# EAGLE design kline to db9 (EAGLE 4.13)
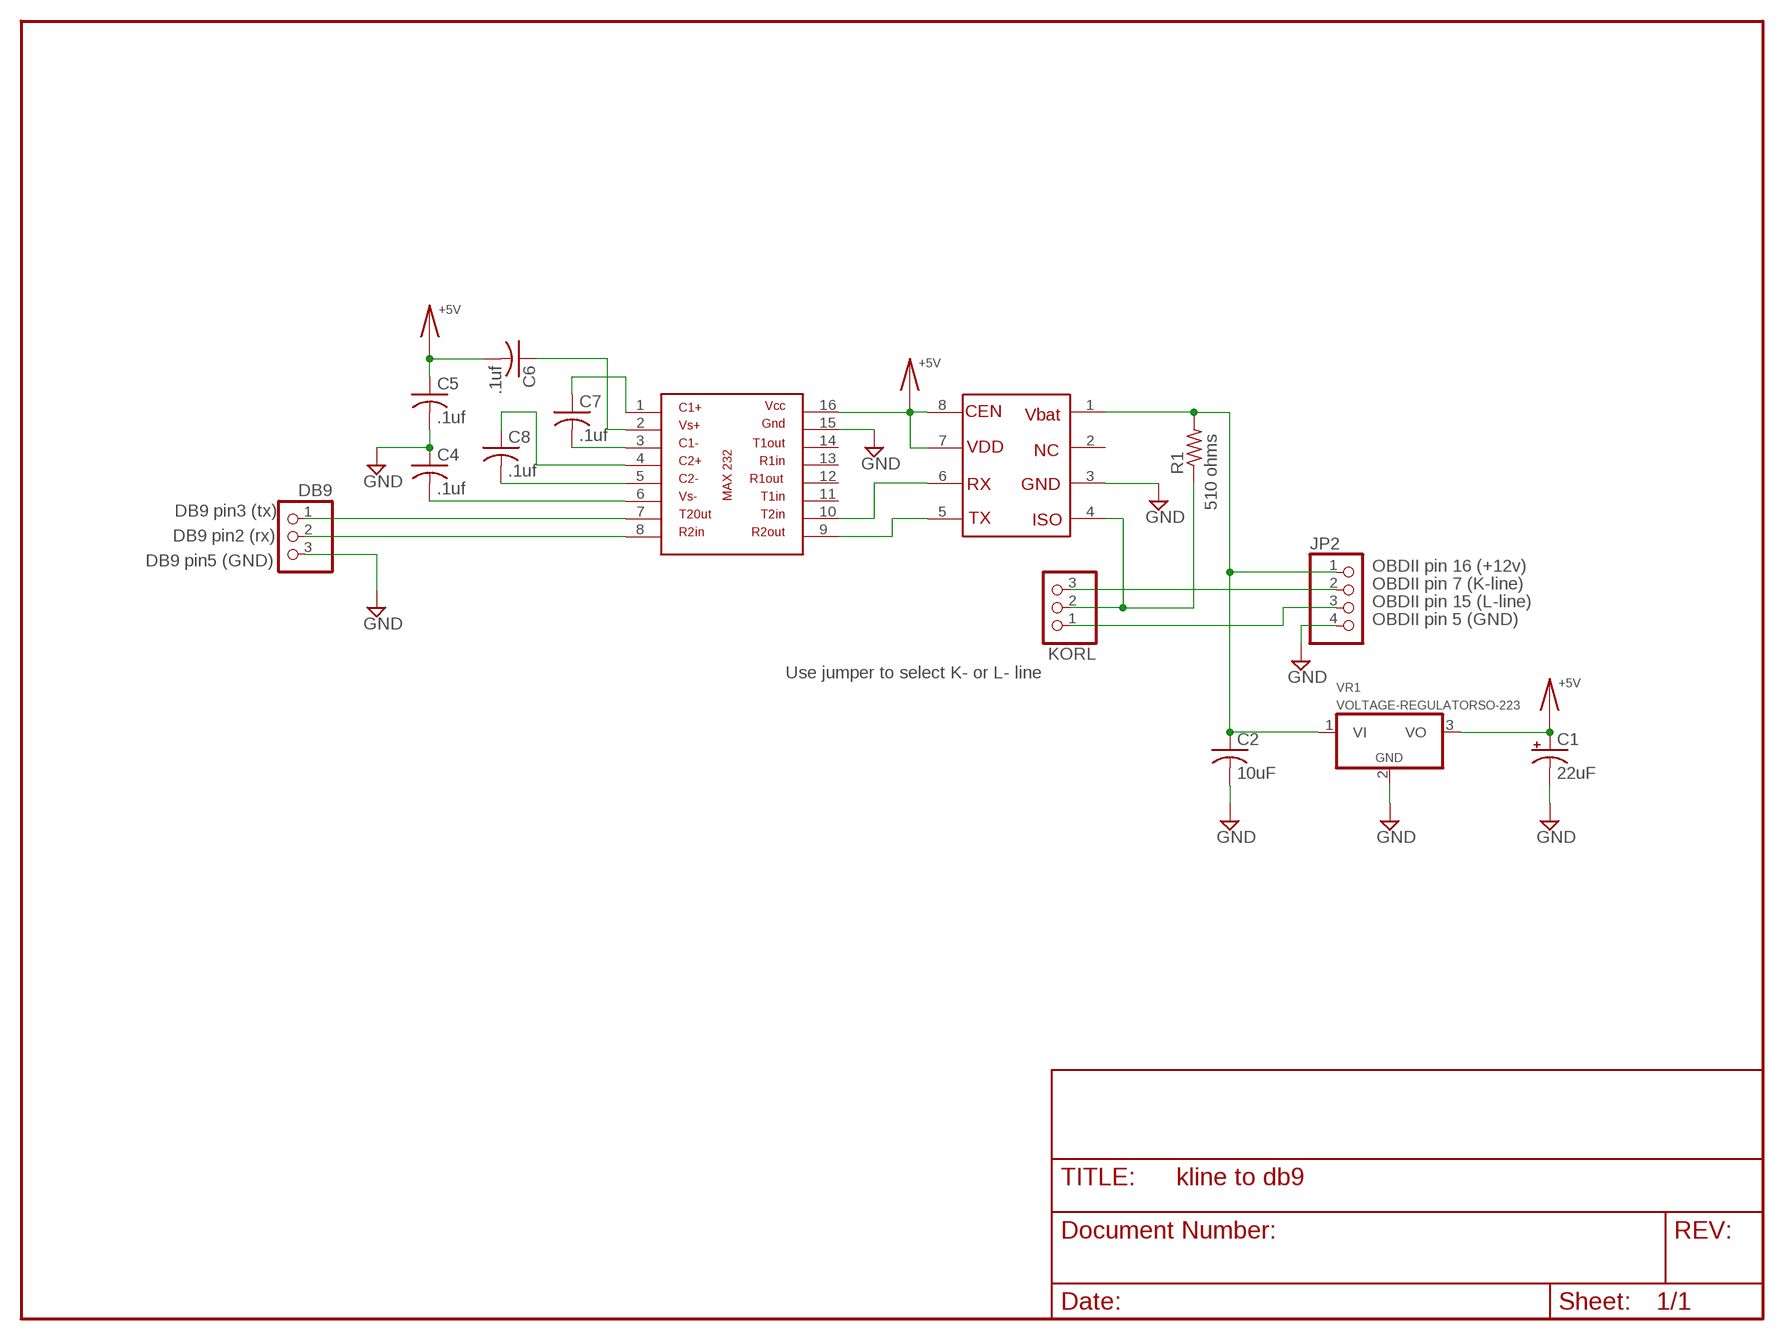
[diagram p0: schematic, sheet 1]

## Parts
C1  22uF  CAPACITOR-ELECTROLYTICD  [PANASONIC_D]
C2  10uF  CAPACITOR-NO-POLARITYC1210K  [C1210K]
C4  .1uf  CAPACITOR-NO-POLARITYC1210K  [C1210K]
C5  .1uf  CAPACITOR-NO-POLARITYC1210K  [C1210K]
C6  .1uf  CAPACITOR-NO-POLARITYC1210K  [C1210K]
C7  .1uf  CAPACITOR-NO-POLARITYC1210K  [C1210K]
C8  .1uf  CAPACITOR-NO-POLARITYC1210K  [C1210K]
DB9  PINHD-1X3  [1X03]
JP2  PINHD-1X4  [1X04]
KORL  PINHD-1X3  [1X03]
MCZ33290  MCZ33290  [SO08]
R1  510 ohms  RESISITOR0411/15  [0411/15]
U$1  MAX232  [SO16]
VR1  VOLTAGE-REGULATORSO-223  [SOT223R_INFINEON]

## Nets
+5V: C1.+ C5.1 C6.2 MCZ33290.7 MCZ33290.8 U$1.16 VR1.3(VO)
GND: C1.- C2.2 C4.1 C5.2 DB9.3 JP2.4 MCZ33290.3 U$1.15 VR1.2(GND)
N$1: JP2.2 KORL.3
N$2: C2.1 JP2.1 MCZ33290.1 R1.2 VR1.1(VI)
N$3: KORL.2 MCZ33290.4 R1.1
N$4: JP2.3 KORL.1
N$6: MCZ33290.6 U$1.10
N$7: MCZ33290.5 U$1.9
N$8: DB9.1 U$1.7
N$9: DB9.2 U$1.8
N$13: C6.1 U$1.2
N$14: C7.2 U$1.3
N$15: C7.1 U$1.1
N$16: C8.2 U$1.5
N$17: C4.2 U$1.6
N$18: C8.1 U$1.4
Unconnected: MCZ33290.2 U$1.11 U$1.12 U$1.13 U$1.14

## Notes on the sheet
- DB9 pin3 (tx)
- DB9 pin2 (rx)
- DB9 pin5 (GND)
- OBDII pin 16 (+12v)
- OBDII pin 7 (K-line)
- OBDII pin 15 (L-line)
- OBDII pin 5 (GND)
- Use jumper to select K- or L- line

## Library data of the parts
C1 = 1 Dan's Common Parts:CAPACITOR-ELECTROLYTIC: POLARIZED CAPACITOR, American symbol
C2 C4-C8 = 1 Dan's Common Parts:CAPACITOR-NO-POLARITY: CAPACITOR, American symbol
DB9 KORL = pinhead:PINHD-1X3: PIN HEADER
JP2 = pinhead:PINHD-1X4: PIN HEADER
MCZ33290 = 1 Dan's Common Parts:MCZ33290
R1 = 1 Dan's Common Parts:RESISITOR: RESISTOR, American symbol
U$1 = 1 Dan's Common Parts:MAX232
VR1 = 1 Dan's Common Parts:VOLTAGE-REGULATOR: Positive VOLTAGE REGULATOR Source: http://cache.national.com/ds/LM/LM78L05.pdf http://www.fairchildsemi.com/ds/LM/LM7805.pdf

## Board
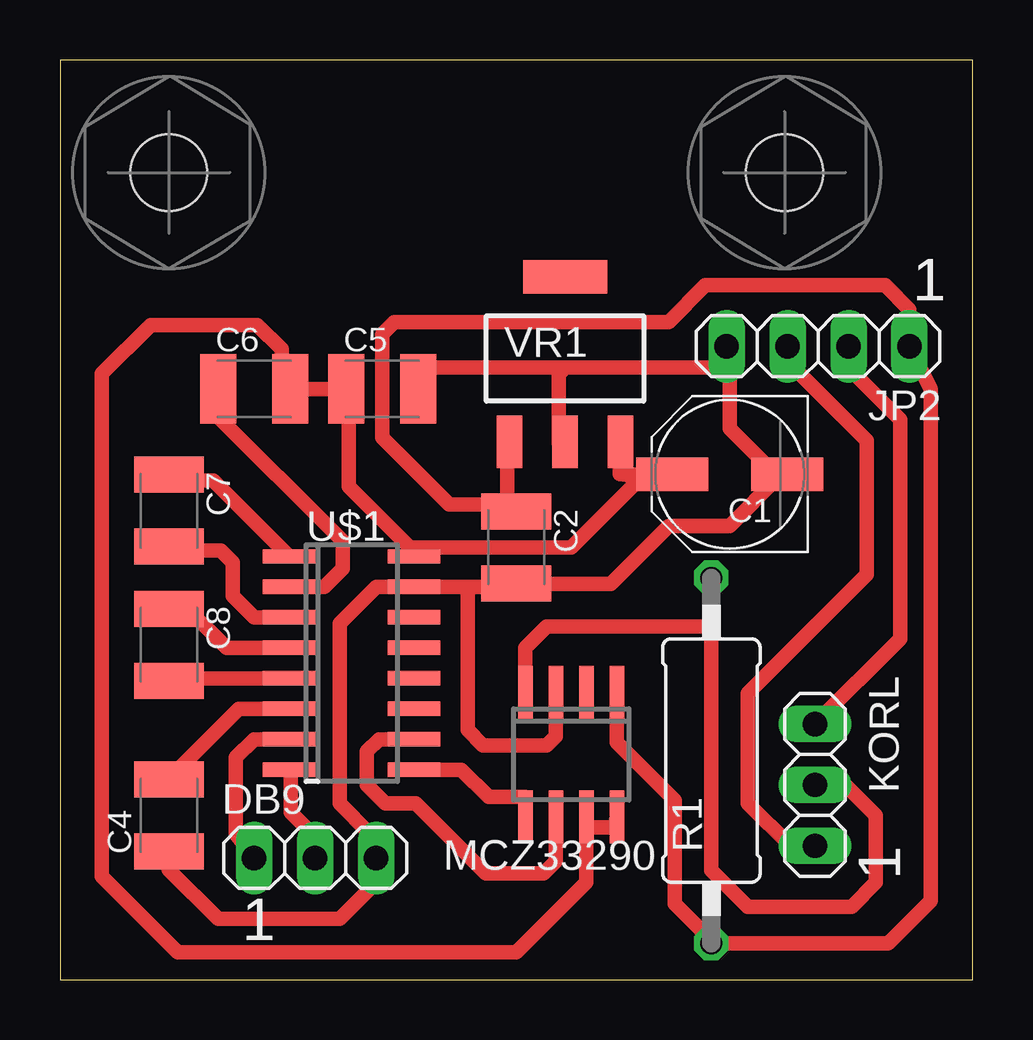
[diagram p1: board, top side]

Size 38.02 x 38.34 mm. Coordinates in mm from the lower left corner, seen from the top.
Outline: 0,0 38.02,0 38.02,38.34 0,38.34 0,0
Copper layers (1*16): Top 0.035mm / dielectric 1.5mm / Bottom 0.035mm
Design rules "default": minimum track width 15mil, minimum drill 24mil, track to track 15mil, track to pad 15mil, pad to pad 15mil, via to via 15mil, smd to smd 8mil, copper to edge 40mil, drill to drill 8mil, minimum pad ring 10mil, minimum via ring 8mil, stop-mask expansion 4mil, vias tented up to drill 0mil, thermal gap 10mil

### Footprints (pad centres in the part's own frame; a part is rotated, then mirrored left to right if it is on the bottom)
PANASONIC_D = smd 3 x 1.4: + 2.4,0; - -2.4,0
C1210K = smd 1.5 x 2.9: 1 -1.5,0; 2 1.5,0
1X03 = drill 1.016 long: 1 -2.54,0; 2 0,0; 3 2.54,0
1X04 = drill 1.016 long: 1 -3.81,0; 2 -1.27,0; 3 1.27,0; 4 3.81,0
SO08 = smd 0.6 x 2.2: 1 -1.905,-2.6; 2 -0.635,-2.6; 3 0.635,-2.6; 4 1.905,-2.6; 5 1.905,2.6; 6 0.635,2.6; 7 -0.635,2.6; 8 -1.905,2.6
0411/15 = drill 0.914 octagon: 1 -7.62,0; 2 7.62,0
SO16 = smd 0.6 x 2.2: 1 -4.445,-2.6; 2 -3.175,-2.6; 3 -1.905,-2.6; 4 -0.635,-2.6; 5 0.635,-2.6; 6 1.905,-2.6; 7 3.175,-2.6; 8 4.445,-2.6; 9 4.445,2.6; 10 3.175,2.6; 11 1.905,2.6; 12 0.635,2.6; 13 -0.635,2.6; 14 -1.905,2.6; 15 -3.175,2.6; 16 -4.445,2.6
SCREW = hole 3.2: 0,0
SOT223R_INFINEON = smd 1.067 x 2.184: 1 -2.311,-3.479; 2 0,-3.48; 3 2.312,-3.48 | smd 3.5 x 1.4: 4 0,3.404

### Placement (x,y rotation side)
C1  27.9,21.08 180 top
C2  19.01,18.03 270 top
C4  4.53,6.85 90 top
C5  13.42,24.63 0 top
C6  8.09,24.63 0 top
C7  4.53,19.55 270 top
C8  4.53,13.96 270 top
DB9  10.63,5.08 0 top
JP2  31.59,26.41 180 top
KORL  31.46,8.12 90 top
MCZ33290  21.3,9.39 180 top
R1  27.14,9.14 270 top
U$1  12.15,13.2 270 top
U$3  [SCREW]  4.53,33.65 0 top
U$4  [SCREW]  30.19,33.65 0 top
VR1  21.04,25.9 0 top

### Tracks (layer width: path | path; a pad name or v marks a point on that pad's centre or on a via)
+5V
  Top 0.61: 9.36,24.63 C5.1 12.03,24.53 12.03,20.57 | 9.36,24.63 C6.2 | VR1.3 23.33,22.4 23.33,21.08 | U$1.16 14.69,17.71 14.69,17.9 | 12.03,20.57 14.69,17.9 | 12.03,20.57 12.03,24.63 9.36,24.63 | 9.36,24.63 9.23,24.76 9.23,26.28 8.22,27.3 3.77,27.3 1.74,25.27 1.74,4.31 4.92,1.14 19.01,1.14 21.93,4.06 MCZ33290.7 21.99,6.34 23.14,6.34 MCZ33290.8 | 14.69,17.9 14.69,18.03 21.3,18.03 24.09,20.82 24.85,20.82 | C1.+ 24.35,21.08 24.85,20.82 | 25.11,20.82 24.85,20.82 | 23.33,21.08 25.11,21.05 | 25.36,20.82 25.11,20.82 | 25.11,20.82 23.33,21.08
GND
  Top 0.61: C5.2 15.18,25.52 20.79,25.52 | 20.79,25.52 20.92,25.39 20.79,25.27 20.79,22.35 | 20.79,22.35 20.97,22.35 VR1.2 20.79,22.68 20.79,25.52 | 20.79,22.35 21.17,22.22 | 20.77,16.5 C2.2 18.76,16.76 18.63,16.76 18,16.38 16.98,16.38 | 4.53,5.58 C4.1 4.53,4.59 6.59,2.53 11.65,2.53 13.3,4.19 13.3,4.44 DB9.3 12.92,5.33 12.92,6.09 11.65,7.36 11.65,14.85 13.17,16.38 14.57,16.38 | MCZ33290.3 20.66,10.15 20.28,9.77 17.61,9.77 16.98,10.41 16.98,16.38 | 14.57,16.38 14.44,16.38 | 16.98,16.38 U$1.15 14.57,16.38 | 16.98,16.38 17.11,16.38 | 30.06,21.08 C1.- | 30.19,21.2 29.93,21.08 | 30.06,21.08 29.93,21.08 | 29.93,21.08 29.93,20.95 | 29.93,20.95 27.9,22.98 27.9,25.14 | 27.9,25.14 JP2.4 | 20.79,25.52 28.03,25.52 27.9,25.14 | 30.19,21.2 30.19,21.33 | 20.77,16.5 20.54,16.5 | 20.77,16.5 22.95,16.5 25.36,18.92 27.9,18.92 29.93,20.95 | 29.93,20.95 30.06,21.08 | 30.06,21.08 30.19,21.2
N$1
  Top 0.61: JP2.2 32.73,25.65 35.01,23.36 35.01,14.22 KORL.3
N$2
  Top 0.61: C2.1 18.66,19.93 18.63,19.43 18.63,21.81 VR1.1 | 27.65,1.52 34.51,1.52 36.28,3.3 36.28,24.63 JP2.1 35.4,27.93 34.38,28.95 26.89,28.95 25.36,27.43 13.93,27.43 13.42,26.92 13.42,22.6 16.22,19.81 19.01,19.81 | 19.01,19.81 C2.1 | C2.1 19.24,19.81 19.01,19.81 | R1.2 27.65,1.52 | 27.65,1.52 27.39,1.39 25.62,3.17 25.62,7.49 23.2,9.9 MCZ33290.1
N$3
  Top 0.61: 27.14,14.73 27.14,4.57 28.66,3.04 32.98,3.04 34,4.06 34,6.85 32.47,8.38 32.22,8.38 KORL.2 | 27.14,14.73 R1.1 | MCZ33290.4 19.39,13.84 20.28,14.73 27.14,14.73
N$4
  Top 0.61: KORL.1 30.44,5.58 28.66,7.36 28.66,11.93 33.62,16.89 33.62,22.47 30.19,25.9 JP2.3
N$6
  Top 0.61: U$1.10 13.3,10.03 12.79,9.52 12.79,8.12 13.55,7.36 14.82,7.36 17.74,4.44 20.16,4.44 20.66,4.95 MCZ33290.6
N$7
  Top 0.61: U$1.9 16.73,8.76 17.87,7.62 19.39,7.62 MCZ33290.5 19.39,7.49
N$8
  Top 0.61: U$1.7 8.09,10.03 7.33,9.27 7.33,6.09 DB9.1
N$9
  Top 0.61: 9.61,8.56 9.61,6.98 10.63,5.96 DB9.2 | 9.61,8.56 9.61,8.63 | 9.61,8.56 U$1.8
N$13
  Top 0.61: U$1.2 11.01,16.38 11.77,17.14 11.77,18.28 6.31,23.74 6.31,24.63 C6.1
N$14
  Top 0.61: U$1.3 8.09,15.11 7.2,16 7.2,17.39 6.69,17.9 4.66,17.9 4.66,17.93 C7.2
N$15
  Top 0.61: C7.1 4.53,20.82 6.38,20.82 U$1.1
N$16
  Top 0.61: 9.87,12.57 U$1.5 5.4,12.57 C8.2
N$17
  Top 0.61: U$1.6 7.46,11.3 4.79,8.63 4.41,8.5 4.41,8.48 C4.2
N$18
  Top 0.61: C8.1 5.53,15.23 6.31,14.47 6.95,13.84 U$1.4 9.61,13.84

### Text on the board
tNames: 1 | 1 | 1